# EAGLE design analog_board_fin_proto (EAGLE 9.6.2)
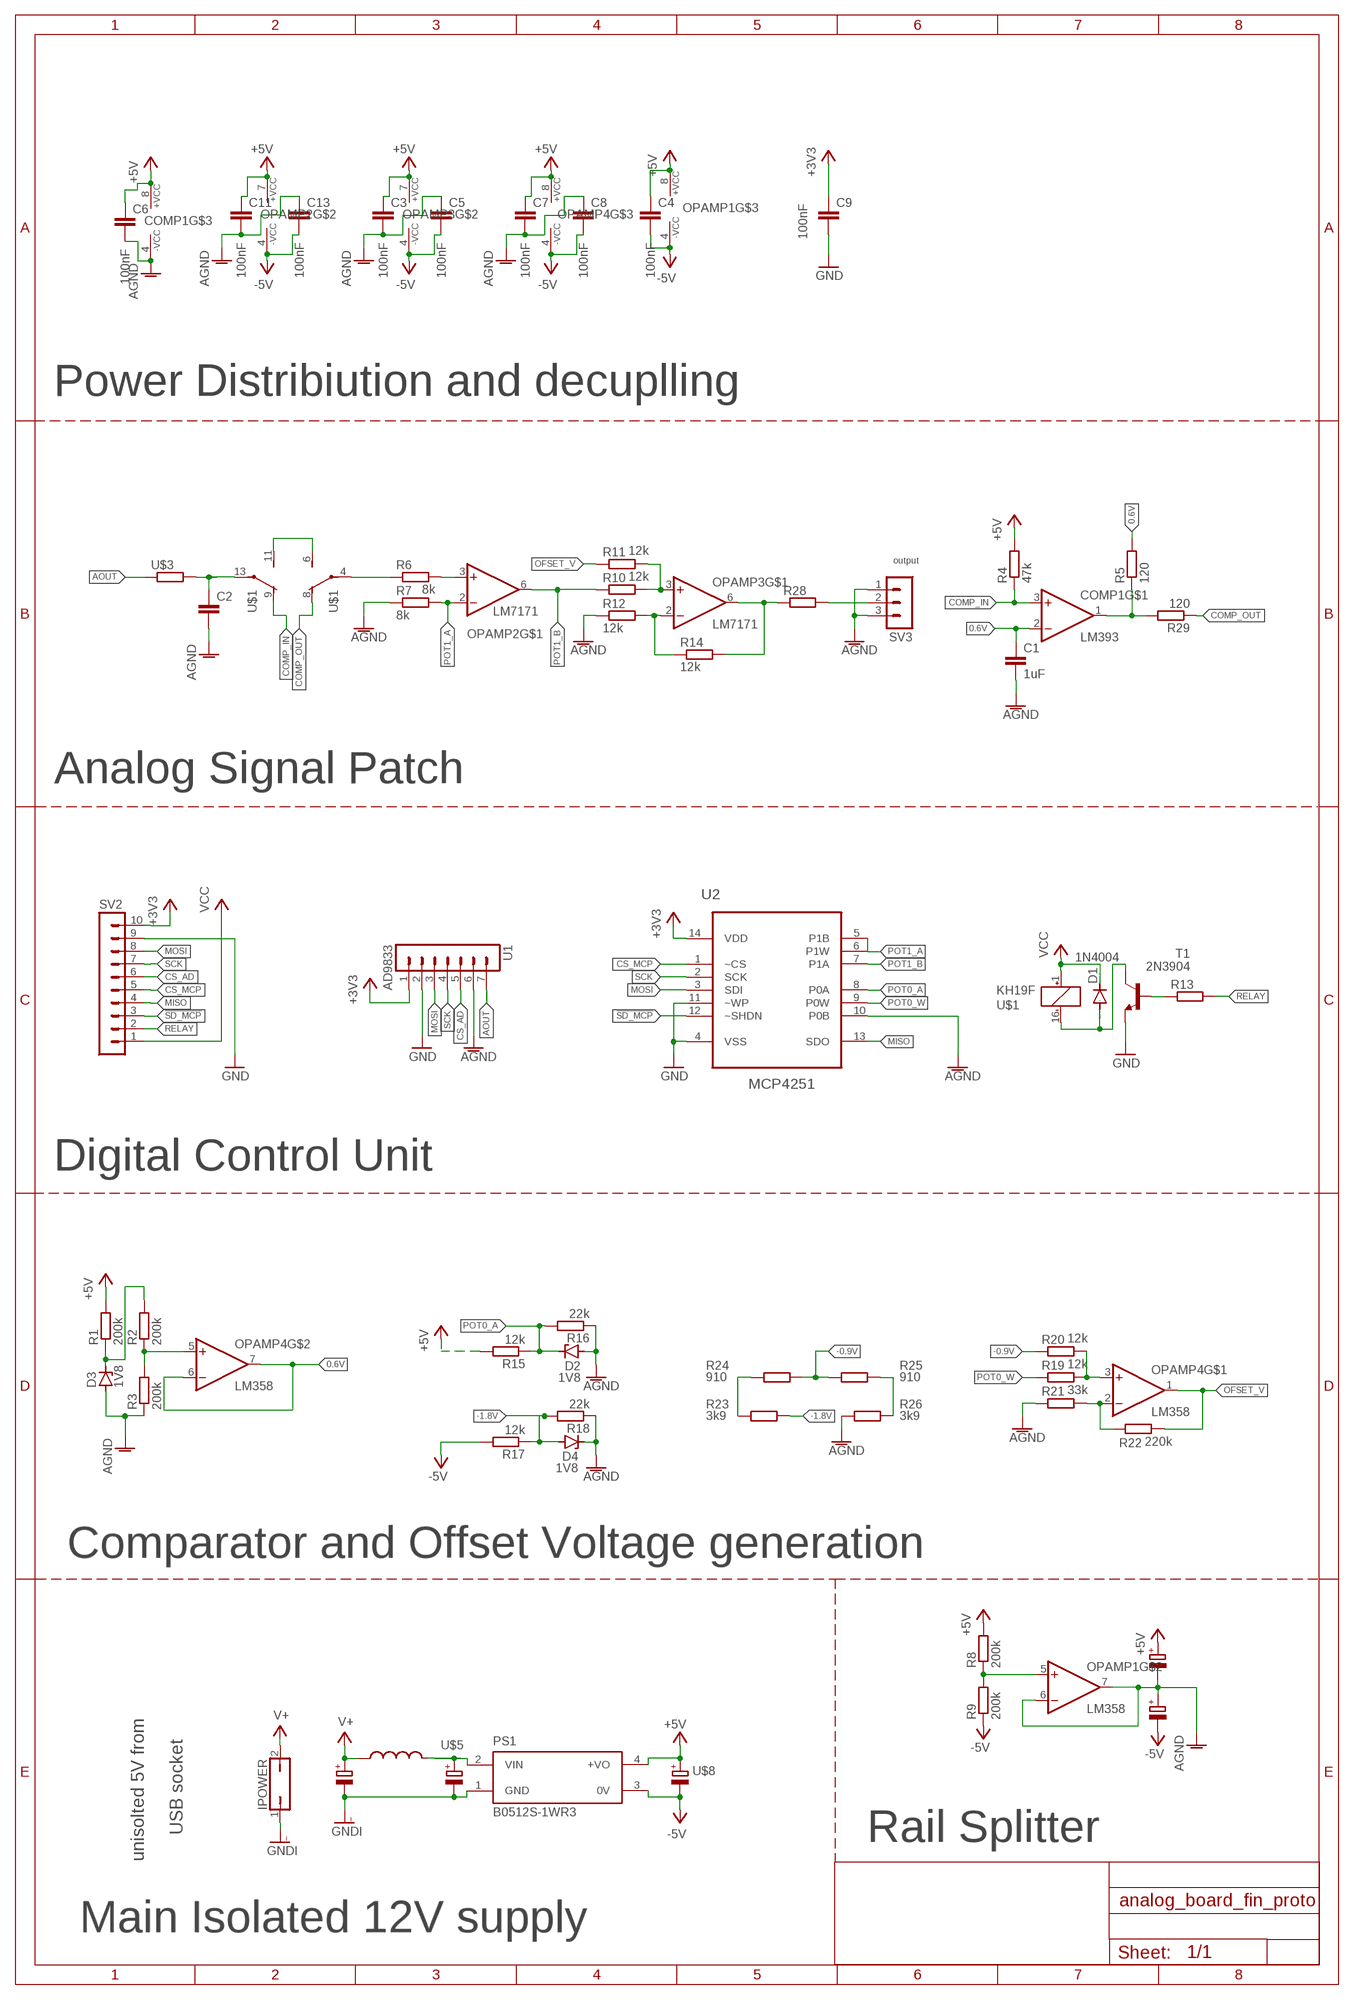
[diagram p0: schematic, sheet 1]

## Parts
C1  1uF  C-EUC0805  [C0805]
C2  C-EU025-025X050  [C025-025X050]
C3  100nF  C-EUC0805  [C0805]
C4  100nF  C-EUC0805  [C0805]
C5  100nF  C-EUC0805  [C0805]
C6  100nF  C-EUC0805  [C0805]
C7  100nF  C-EUC0805  [C0805]
C8  100nF  C-EUC0805  [C0805]
C9  100nF  C-EUC0805  [C0805]
C11  100nF  C-EUC0805  [C0805]
C13  100nF  C-EUC0805  [C0805]
COMP1  LM393  [DIL08]
D1  1N4004  [DO41-10]
D2  1V8  ZENER-DIODESOD80C  [SOD80C]
D3  1V8  ZENER-DIODESOD80C  [SOD80C]
D4  1V8  ZENER-DIODESOD80C  [SOD80C]
IPOWER  POT  JP1Q  [JP1]
OPAMP1  LM358  [DIL08]
OPAMP2  LM7171  [DIL08]
OPAMP3  LM7171  [DIL08]
OPAMP4  LM358  [DIL08]
PS1  B0512S-1WR3  [CONV_B0512S-1WR3]
R1  200k  R-EU_R0805  [R0805]
R2  200k  R-EU_R0805  [R0805]
R3  200k  R-EU_R0805  [R0805]
R4  47k  R-EU_R0805  [R0805]
R5  120  R-EU_R0805  [R0805]
R6  8k  R-EU_R0805  [R0805]
R7  8k  R-EU_R0805  [R0805]
R8  200k  R-EU_R0805  [R0805]
R9  200k  R-EU_R0805  [R0805]
R10  12k  R-EU_R0805  [R0805]
R11  12k  R-EU_R0805  [R0805]
R12  12k  R-EU_R0805  [R0805]
R13  R-EU_R0805  [R0805]
R14  12k  R-EU_R0805  [R0805]
R15  12k  R-EU_R0805  [R0805]
R16  22k  R-EU_R0805  [R0805]
R17  12k  R-EU_R0805  [R0805]
R18  22k  R-EU_R0805  [R0805]
R19  12k  R-EU_R0805  [R0805]
R20  12k  R-EU_R0805  [R0805]
R21  33k  R-EU_R0805  [R0805]
R22  220k  R-EU_R0805  [R0805]
R23  3k9  R-EU_R0805  [R0805]
R24  910  R-EU_R0805  [R0805]
R25  910  R-EU_R0805  [R0805]
R26  3k9  R-EU_R0805  [R0805]
R28  R-EU_R2512  [R2512]
R29  120  R-EU_R0805  [R0805]
SV2  MA10-1  [MA10-1]
SV3  MA03-1  [MA03-1]
T1  2N3904  [TO92]
U1  AD9833  MA07-1  [MA07-1]
U2  MCP4251  [DIL14]
U$1  KH19F  [BT-XX-S]
U$3  RESISTOR  [0207/10]
U$5  CAPACITOR  [E2,5-7]
U$6  100nF  CAPACITOR  [E2,5-7]
U$7  INDUCTOR  [0207/10]
U$8  CAPACITOR  [E2,5-7]
U$9  CAPACITOR  [E2,5-7]
U$10  CAPACITOR  [E2,5-7]

## Nets
0.6V: C1.1 COMP1.2(-IN) OPAMP4.6(-IN) OPAMP4.7(OUT) R5.2
!SD_MCP: SV2.3 U2.12(~SHDN)
+3V3: C9.1 SV2.10 U1.1 U2.14(VDD)
+5V: C3.1 C4.1 C6.1 C7.1 C11.1 COMP1.8(VCC) OPAMP1.8(VCC) OPAMP2.7(VCC) OPAMP3.7(VCC) OPAMP4.8(VCC) PS1.4(+VO) R1.2 R4.2 R8.2 R15.2 U$8.+ U$9.+
-0.9V: R20.1 R24.1 R25.2
-1.8V: D4.A R17.1 R18.2 R23.2
-5V: C4.2 C5.2 C8.2 C13.2 OPAMP1.4(GND) OPAMP2.4(GND) OPAMP3.4(GND) OPAMP4.4(GND) PS1.3(0V) R9.1 R17.2 U$8.- U$10.-
AGND: C1.2 C2.2 C3.2 C5.1 C6.2 C7.2 C8.1 C11.2 C13.1 COMP1.4(GND) D2.A D3.A D4.C OPAMP1.6(-IN) OPAMP1.7(OUT) R3.1 R7.1 R12.1 R16.1 R18.1 R21.1 R26.1 SV3.1 SV3.3 U1.6 U2.10(P0B) U$9.- U$10.+
AOUT: U1.7 U$3.1
COMP_IN: COMP1.3(+IN) R4.1 U$1.9(O)
COMP_OUT: R29.1 U$1.8(O)
CS_AD: SV2.6 U1.5
CS_MCP: SV2.5 U2.1(~CS)
GND: C9.2 SV2.9 T1.3(E) U1.2 U2.4(VSS) U2.11(~WP)
GNDI: IPOWER.1 PS1.1(GND) U$5.- U$6.-
MISO: SV2.4 U2.13(SDO)
MOSI: SV2.8 U1.3 U2.3(SDI)
N$1: OPAMP4.5(+IN) R2.1 R3.2
N$2: U$1.6(S) U$1.11(S)
N$3: C2.1 U$1.13(P) U$3.2
N$4: D3.C R1.1 R2.2
N$5: OPAMP3.3(+IN) R10.2 R11.2
N$6: R6.1 U$1.4(P)
N$7: OPAMP3.6(OUT) R14.2 R28.1
N$8: OPAMP3.2(-IN) R12.2 R14.1
N$9: OPAMP1.5(+IN) R8.1 R9.2
N$10: OPAMP4.3(+IN) R19.2 R20.2
N$11: R28.2 SV3.2
N$12: OPAMP2.3(+IN) R6.2
N$13: R23.1 R24.2
N$14: OPAMP4.2(-IN) R21.2 R22.1
N$15: R25.1 R26.2
N$17: PS1.2(VIN) U$5.+ U$7.2
N$18: D1.A T1.1(C) U$1.16(-)
N$19: COMP1.1(OUT) R5.1 R29.2
N$21: R13.1 T1.2(B)
OFSET_V: OPAMP4.1(OUT) R11.1 R22.2
POT0_A: D2.C R15.1 R16.2 U2.8(P0A)
POT0_W: R19.1 U2.9(P0W)
POT1_A: OPAMP2.2(-IN) R7.2 U2.5(P1B) U2.6(P1W)
POT1_B: OPAMP2.6(OUT) R10.1 U2.7(P1A)
RELAY: R13.2 SV2.2
SCK: SV2.7 U1.4 U2.2(SCK)
V+: IPOWER.2 U$6.+ U$7.1
VCC: D1.C SV2.1 U$1.1(+)
Unconnected: COMP1.5(+IN) COMP1.6(-IN) COMP1.7(OUT) OPAMP1.1(OUT) OPAMP1.2(-IN) OPAMP1.3(+IN)

## Notes on the sheet
- Power Distribiution and decuplling
- output
- Analog Signal Patch
- Digital Control Unit
- Comparator and Offset Voltage generation
- unisolted 5V from
- USB socket
- Rail Splitter
- Main Isolated 12V supply

## Library data of the parts
C1-C9 C11 C13 = rcl:C-EU: CAPACITOR, European symbol; SPICEPREFIX: C
COMP1 = for_hommade_printing:LM393
D1 = diode:1N4004: DIODE general purpose rectifier, 1 A
D2-D4 = diode:ZENER-DIODE: Z-Diode
IPOWER = jumper:JP1Q: JUMPER
OPAMP1 OPAMP4 = for_hommade_printing:LM358
OPAMP2 OPAMP3 = for_hommade_printing:LM7171
PS1 = for_hommade_printing:B0512S-1WR3: DC/DC Converter Check availability <https://pricing.snapeda.com/parts/B0512S-1WR3/Mornsun%20America%2C%20LLC/view-part?ref=eda>; AVAILABILITY: In Stock; DESCRIPTION: Isolated Module DC DC Converter 1 Output 12V - - - 84mA 4.5V - 5.5V Input; MF: Mornsun America, LLC; MP: B0512S-1WR3; PACKAGE: SIP-4-4 MORNSUN; PRICE: None; PURCHASE-URL: https://pricing.snapeda.com/search/part/B0512S-1WR3/?ref=eda
R1-R26 R28 R29 = rcl:R-EU_: RESISTOR, European symbol; SPICEPREFIX: R
SV2 = con-lstb:MA10-1: PIN HEADER; OC_FARNELL: unknown; OC_NEWARK: unknown
SV3 = con-lstb:MA03-1: PIN HEADER; OC_FARNELL: unknown; OC_NEWARK: unknown
T1 = transistor:2N3904: NPN TRANSISTOR
U1 = con-lstb:MA07-1: PIN HEADER; OC_FARNELL: unknown; OC_NEWARK: unknown
U2 = for_hommade_printing:MCP4251
U$1 = for_hommade_printing:KH19F
U$3 = for_hommade_printing:RESISTOR
U$5 U$6 U$8-U$10 = for_hommade_printing:CAPACITOR
U$7 = for_hommade_printing:INDUCTOR

## Board
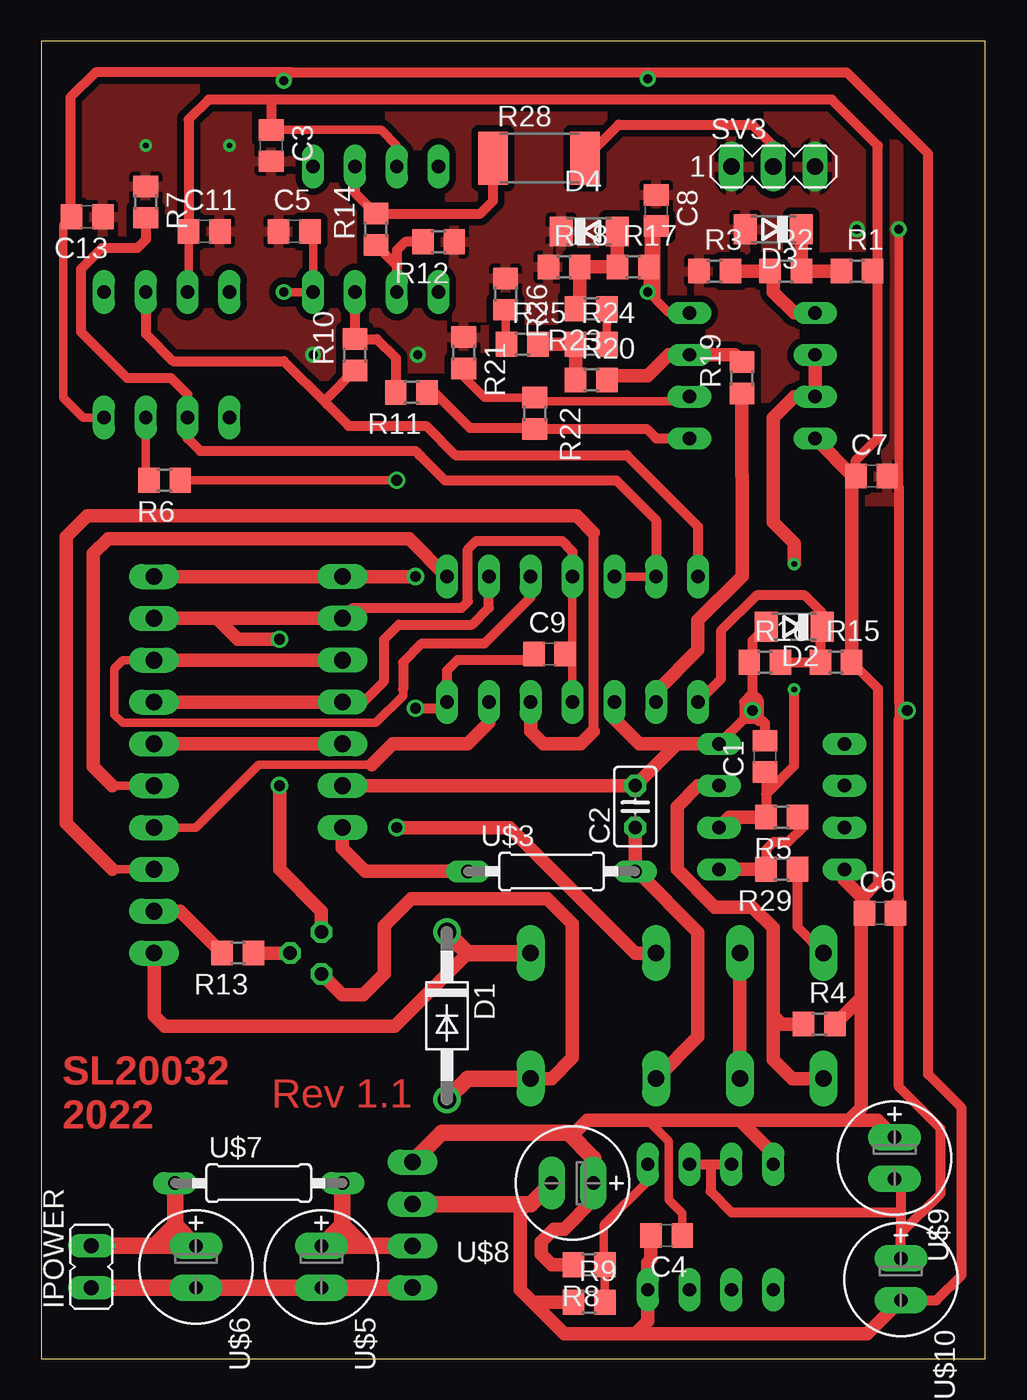
[diagram p1: board, top side]
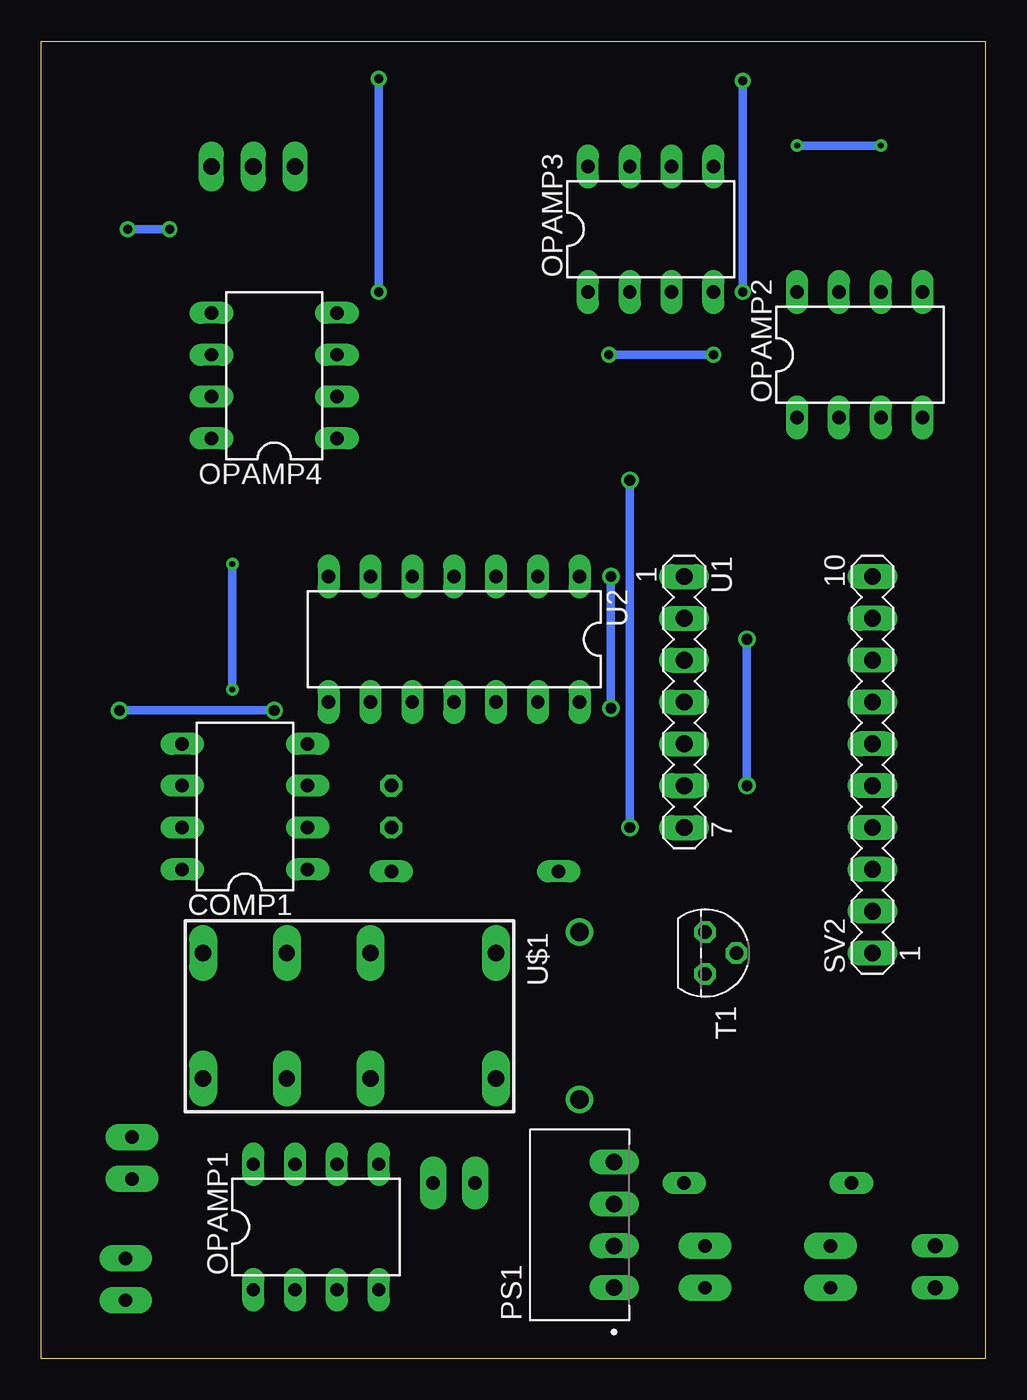
[diagram p2: board, bottom side, seen from below]

Size 57.33 x 80 mm. Coordinates in mm from the lower left corner, seen from the top.
Outline: 0,0 57.33,0 57.33,80 0,80 0,0
Copper layers (1*16): Top 0.035mm / dielectric 1.5mm / Bottom 0.035mm
Design rules "default *": minimum track width 6mil, minimum drill 0.35mm, track to track 10mil, track to pad 10mil, pad to pad 10mil, via to via 10mil, smd to smd 10mil, copper to edge 40mil, drill to drill 6mil, minimum pad ring 10mil, minimum via ring 8mil, stop-mask expansion 4mil, vias tented up to drill 0mil, thermal gap 10mil

### Footprints (pad centres in the part's own frame; a part is rotated, then mirrored left to right if it is on the bottom)
C0805 = smd 1.3 x 1.5: 1 -0.95,0; 2 0.95,0
C025-025X050 = drill 0.813 octagon: 1 -1.27,0; 2 1.27,0
DIL08 = drill 0.813 long: 1 -3.81,-3.81; 2 -1.27,-3.81; 3 1.27,-3.81; 4 3.81,-3.81; 5 3.81,3.81; 6 1.27,3.81; 7 -1.27,3.81; 8 -3.81,3.81
DO41-10 = drill 1.118: A 5.08,0; C -5.08,0
SOD80C = smd 1.4 x 1.8: A 1.7,0; C -1.7,0
JP1 = drill 0.914 long: 1 0,-1.27; 2 0,1.27
CONV_B0512S-1WR3 = drill 1 long: 1 -3.81,-2.1; 2 -1.27,-2.1; 3 1.27,-2.1; 4 3.81,-2.1
R0805 = smd 1.3 x 1.5: 1 -0.95,0; 2 0.95,0
R2512 = smd 1.8 x 3.2: 1 -2.8,0; 2 2.8,0
MA10-1 = drill 1.016 long: 1 -11.43,0; 2 -8.89,0; 3 -6.35,0; 4 -3.81,0; 5 -1.27,0; 6 1.27,0; 7 3.81,0; 8 6.35,0; 9 8.89,0; 10 11.43,0
MA03-1 = drill 1.016 long: 1 -2.54,0; 2 0,0; 3 2.54,0
TO92 = drill 0.813 octagon: 1 1.27,0; 2 0,1.905; 3 -1.27,0
MA07-1 = drill 1.016 long: 1 -7.62,0; 2 -5.08,0; 3 -2.54,0; 4 0,0; 5 2.54,0; 6 5.08,0; 7 7.62,0
DIL14 = drill 0.813 long: 1 -7.62,-3.81; 2 -5.08,-3.81; 3 -2.54,-3.81; 4 0,-3.81; 5 2.54,-3.81; 6 5.08,-3.81; 7 7.62,-3.81; 8 7.62,3.81; 9 5.08,3.81; 10 2.54,3.81; 11 0,3.81; 12 -2.54,3.81; 13 -5.08,3.81; 14 -7.62,3.81
BT-XX-S = drill 1 pad 1.7 long: 1 -8.89,-3.81; 4 -1.27,-3.81; 6 3.81,-3.81; 8 8.89,-3.81; 9 8.89,3.81; 11 3.81,3.81; 13 -1.27,3.81; 16 -8.89,3.81
0207/10 = drill 0.813 long: 1 -5.08,0; 2 5.08,0
E2,5-7 = drill 0.813 pad 1.6 long: + -1.27,0; - 1.27,0

### Placement (x,y rotation side)
C1  43.94,36.58 90 top
C2  36.07,33.53 90 top
C3  13.97,73.66 270 top
C4  37.97,7.49 180 top
C5  15.37,68.45 0 top
C6  50.93,27.05 0 top
C7  50.42,53.59 0 top
C8  37.34,69.72 270 top
C9  30.86,42.8 0 top
C11  9.91,68.45 0 top
C13  2.79,69.34 180 top
COMP1  44.96,33.53 90 bottom
D1  24.64,20.83 270 top
D2  45.72,44.45 180 top
D3  44.45,68.58 180 top
D4  33.27,68.45 0 top
IPOWER  3.05,5.59 0 top
OPAMP1  40.64,8 0 bottom
OPAMP2  7.62,60.96 0 bottom
OPAMP3  20.32,68.58 0 bottom
OPAMP4  43.18,59.69 90 bottom
PS1  24.64,8.13 90 bottom
R1  49.53,66.04 0 top
R2  45.21,66.04 0 top
R3  40.89,66.04 0 top
R4  47.24,20.32 0 top
R5  44.96,32.89 180 top
R6  7.49,53.34 180 top
R7  6.35,70.23 270 top
R8  33.27,5.71 180 top
R9  33.27,3.43 0 top
R10  19.05,60.96 90 top
R11  22.48,58.67 180 top
R12  24.13,67.82 180 top
R13  11.94,24.64 180 top
R14  20.32,68.58 90 top
R15  48.26,42.29 0 top
R16  43.94,42.29 0 top
R17  35.94,66.29 0 top
R18  31.75,66.29 0 top
R19  42.55,59.56 90 top
R20  33.4,59.44 0 top
R21  25.65,61.09 270 top
R22  29.97,57.4 270 top
R23  33.4,63.75 180 top
R24  33.4,61.59 0 top
R25  29.21,61.59 0 top
R26  28.19,64.64 270 top
R28  30.23,72.9 0 top
R29  44.96,29.72 180 top
SV2  6.86,36.07 90 bottom
SV3  44.45,72.39 0 top
T1  17.02,24.64 270 bottom
U1  18.29,39.88 270 bottom
U2  32.26,43.69 180 bottom
U$1  38.61,20.83 180 bottom
U$3  30.99,29.59 0 top
U$5  17.02,5.59 270 top
U$6  9.4,5.59 270 top
U$7  13.21,10.67 0 top
U$8  32.26,10.67 180 top
U$9  51.82,12.19 270 top
U$10  52.2,4.83 270 top

### Tracks (layer width: path | path; a pad name or v marks a point on that pad's centre or on a via)
0.6V  (via drill 0.35)
  Top 0.508: OPAMP4.7 45.72,58.42 | C1.1 44.01,35.56
  Top 0.61: 44.01,35.56 44.01,34.29 | 44.01,34.29 R5.2 | 44.01,34.29 45.72,36 v45.72,40.64
  Top 0.813: R5.2 41.78,32.89 COMP1.2 | OPAMP4.6 OPAMP4.7 | 45.72,58.42 44.45,57.15 44.45,50.8 45.72,49.53 v45.72,48.26
  Bottom 0.508: v45.72,40.64 v45.72,48.26
!SD_MCP
  Top 0.508: SV2.3 4.32,29.72
  Top 0.61: 33.53,50.16 33.53,38.1
  Top 0.813: 4.32,29.72 1.52,32.51 1.52,49.91 2.79,51.18 32.51,51.18 33.53,50.16 | 33.53,38.1 32.77,37.34 30.48,37.34 29.72,38.1 U2.12
+3V3  (via drill 0.65)
  Top 0.508: C9.1 29.53,42.42
  Top 0.61: v22.73,39.5 24.26,39.5 U2.14 24.64,41.78 25.27,42.42 29.53,42.42
  Top 0.813: SV2.10 U1.1 v22.73,47.5
  Bottom 0.508: v22.73,47.5 v22.73,39.5
+5V
  Top 0.508: U$8.+ 33.53,9.65 | 32,13.72 32.38,13.72 | 44.45,12.45 OPAMP1.8 | 49.78,26.67 49.98,26.86 C6.1 49.91,27.12 49.91,27.94 | C11.1 8.96,64.84 OPAMP2.7 | OPAMP3.7 21.59,73.66 20.64,74.61 C3.1 | 50.8,66.36 R1.2 50.8,65.72 | 36.83,14.48 38.1,13.21 38.1,9.65 38.92,8.83 C4.1 | 49.21,53.34 C7.1 49.28,53.59 | 48.77,29.08 COMP1.8
  Top 0.61: R15.2 50.8,40.7 50.8,28.83 49.91,27.94 | 50.8,66.36 50.8,73.66 48.01,76.45 13.97,76.45 | 13.97,76.45 10.16,76.45 8.96,75.25 C11.1 | 13.97,76.45 C3.1 | C7.1 49.47,54.55 50.8,55.88 50.8,65.72
  Top 0.813: R8.2 30.99,5.71 30.35,6.35 30.35,7.11 31.11,7.87 31.75,7.87 33.53,9.65 | 42.42,14.48 36.83,14.48 33.15,14.48 32.38,13.72 | 42.42,14.48 49.02,14.48 | 49.02,14.48 49.78,15.24 49.78,21.91 | 42.42,14.48 44.45,12.45 | 49.78,26.67 49.78,21.91 | R4.2 49.78,21.91 | 49.02,14.48 50.8,14.48 U$9.+ | R15.2 49.21,53.34 | OPAMP4.8 49.28,53.59 | 49.91,27.94 48.77,29.08
  Top 1.016: U$8.+ 33.53,12.19 32,13.72 24.32,13.72 PS1.4
-0.9V
  Top 0.813: R25.2 R24.1 R20.1
-1.8V
  Top 0.508: D4.A 34.99,68.44 | 32.7,64 R23.2
  Top 0.813: 34.99,68.44 R17.1 R18.2 32.7,64
-5V  (via drill 0.55)
  Top 0.508: 29.72,9.4 29.08,8.76 | C5.2 16.51,68.26 OPAMP3.4 v14.73,64.77 | OPAMP2.4 2.54,57.15 1.34,58.35 1.34,68.83 C13.2 1.78,69.41 | 15.24,78.11 v14.73,77.6 | 36.83,78.11 v36.83,77.72 | OPAMP4.4 38.1,63.5 37.34,64.26 | 37.34,64.26 v36.83,64.77 36.83,66.23 R17.2 36.89,68.33 C8.2 37.34,64.26
  Top 0.61: U$10.- 54.36,3.56 55.88,5.08 55.88,15.24 53.85,17.27 53.85,73.15 48.9,78.11 36.83,78.11 15.24,78.11 3.3,78.11 1.78,76.58 1.78,69.41
  Top 0.813: 29.84,3.43 29.08,4.19 29.08,8.76 | 29.84,3.43 R9.1 | 29.84,3.43 31.75,1.52 36.07,1.52 | 36.07,1.52 36.83,2.29 OPAMP1.4 36.83,5.84 37.02,6.04 C4.2 | U$10.- 50.16,1.52 36.07,1.52
  Top 1.016: U$8.- 29.72,9.4 PS1.3
  Bottom 0.508: v14.73,77.6 v14.73,64.77 | v36.83,77.72 v36.83,64.77
AGND  (via drill 0.35, 0.55, 0.65)
  Top 0.508: U$9.- 52.2,10.54 | 42.67,38.86 v43.18,39.37 43.81,38.73 43.56,38.73 | C6.2 51.88,27.75 | U2.10 34.8,38.86 | 43.18,41.66 42.99,41.84 R16.1 43.18,42.48 | C7.2 52.07,52.89 v52.07,68.58 | 52.07,38.86 52.07,39.88 v52.58,39.37 52.07,38.86
  Top 0.61: OPAMP1.6 40.64,11.81 | 40.64,11.81 OPAMP1.7 | 52.2,10.54 52.2,8.89 | U$10.+ 52.2,7.62 | 52.2,8.89 52.2,7.62 | 40.64,11.81 40.64,10.16 41.91,8.89 52.2,8.89 | 52.2,7.62 54.61,10.03 54.61,13.97 52.07,16.51 52.07,27.94 | 52.07,27.94 52.07,38.86 | COMP1.4 42.67,38.86 | 51.88,27.75 52.07,27.94 | 43.18,41.66 43.18,40.39 | 43.18,40.39 v43.18,39.37 | D2.A 43.18,43.61 43.18,42.48 | C1.2 43.94,38.61 43.81,38.73 | 52.07,52.89 52.07,39.88 | 42.67,38.86 43.56,38.86 | 43.18,40.39 43.56,40.01 43.56,38.86 | 43.56,38.86 43.56,38.73 | 43.18,40.39 42.67,39.88 42.67,38.86
  Top 0.813: U1.6 C2.2 38.61,37.34 | 38.61,37.34 COMP1.4 | 38.61,37.34 36.32,37.34 34.8,38.86
  Bottom 0.508: v43.18,39.37 v52.58,39.37 | v52.07,68.58 v49.53,68.58 | v16.51,60.96 v22.86,60.96 | v6.35,73.66 v11.43,73.66
  pour Top (isolate 0.406): 0,80.01 0,52.07 52.07,52.07 52.07,80.01
AOUT
  Top 0.813: U1.7 18.29,30.99 19.68,29.59 U$3.1
COMP_IN
  Top 0.508: COMP1.3 39.88,34.8
  Top 0.813: 39.88,34.8 38.61,33.53 38.61,29.72 40.89,27.43 43.18,27.43 44.45,26.16 44.45,20.83 | U$1.9 45.59,17.02 44.45,18.16 44.45,20.83 | 44.45,20.83 44.96,20.32 R4.1
COMP_OUT
  Top 0.61: R29.1 45.91,26.23 U$1.8
CS_AD
  Top 0.813: SV2.6 U1.5
CS_MCP
  Top 0.508: SV2.5 4.32,34.8
  Top 0.813: 4.32,34.8 3.17,35.94 3.17,48.9 4.06,49.78 22.35,49.78 U2.1
GND  (via drill 0.65)
  Top 0.508: U2.4 32.26,43.18 | 32.26,43.18 U2.11 | C9.2 32.19,43.18 32.26,43.18
  Top 0.61: U1.2 18.92,45.59 25.53,45.59 25.91,45.97 25.91,49.15 26.42,49.66 31.62,49.66 32.26,49.02 U2.4
  Top 0.813: U1.2 10.67,44.96 | 10.67,44.96 SV2.9 | 10.67,44.96 11.94,43.69 v14.48,43.69 | v14.48,34.8 14.48,29.72 17.02,27.18 T1.3
  Bottom 0.508: v14.48,43.69 v14.48,34.8
GNDI
  Top 1.016: IPOWER.1 U$6.- U$5.- PS1.1
MISO
  Top 0.508: SV2.4 9.4,32.26 13.21,36.07 20.07,36.07
  Top 0.813: 20.07,36.07 21.34,37.34 25.91,37.34 27.18,38.61 U2.13
MOSI
  Top 0.508: 29.72,46.23 U2.3 | 5.71,42.42 SV2.8 4.95,42.42 4.45,41.91 4.45,39.12 4.95,38.61 20.32,38.61 21.97,40.26 21.97,40.64
  Top 0.61: 29.72,46.23 26.92,43.43 23.11,43.43 21.97,42.29 21.97,40.64
  Top 0.813: U1.3 SV2.8
N$1
  Top 0.508: R2.1 44.45,65.85
  Top 0.813: R3.2 R2.1 | 44.45,65.85 44.45,64.77 45.72,63.5 OPAMP4.5
N$2
  Top 0.813: U$1.6 U$1.11
N$3
  Top 0.508: U$3.2 36.2,29.59
  Top 0.813: U$1.13 39.88,19.56 39.88,25.91 36.2,29.59 | C2.1 U$3.2
N$4
  Top 0.508: D3.C 46.16,68.57
  Top 0.813: R1.1 R2.2 46.16,68.57
N$5
  Top 0.61: OPAMP3.3 R10.2 20.39,61.91 21.53,60.77 R11.2
N$6  (via drill 0.65)
  Top 0.508: R6.1 v21.59,53.34
  Top 0.813: U$1.4 36.07,24.64 28.45,32.26 v21.59,32.26
  Bottom 0.508: v21.59,32.26 v21.59,53.34
N$7
  Top 0.61: OPAMP3.6 19.05,70.8 R14.2 26.67,69.53 27.43,70.29 R28.1
N$8
  Top 0.61: R14.1 21.59,66.36 | 21.59,66.36 OPAMP3.2 | R12.2 22.1,67.82 21.59,67.31 21.59,66.36
N$9
  Top 0.508: R9.2 R8.1 34.16,5.78 34.16,8.13 36.83,10.79 OPAMP1.5
N$10
  Top 0.508: R20.2 34.6,59.69 | 38.1,60.96 OPAMP4.3
  Top 0.813: 34.6,59.69 36.83,59.69 38.1,60.96 | OPAMP4.3 42.1,60.96 R19.2
N$11
  Top 0.508: 44.45,73.66 SV3.2
  Top 0.61: R28.2 35.06,74.93 43.18,74.93 44.45,73.66
N$12
  Top 0.508: R6.2 6.35,53.53 OPAMP2.3
N$13
  Top 0.508: R23.1 R24.2
N$14
  Top 0.508: R21.2 25.65,59.62 26.92,58.35 R22.1 29.97,58.17 30.01,58.13 39.08,58.13 OPAMP4.2
N$15
  Top 0.508: R26.2 28.19,61.66 R25.1
N$17
  Top 1.016: U$7.2 18.29,8.13 | 18.29,8.13 U$5.+ 19.56,6.86 | 18.29,8.13 19.56,6.86 | PS1.2 19.56,6.86
N$18
  Top 0.813: U$1.16 30.99,17.02 32.26,18.29 32.26,26.42 30.73,27.94 22.48,27.94 20.83,26.29 20.83,23.37 19.56,22.1 18.29,22.1 T1.1
  Top 1.016: D1.A 25.91,17.02 U$1.16
N$19
  Top 0.508: R5.1 46.23,32.57 46.23,32.26
  Top 0.61: 46.23,32.26 45.34,31.37 44.45,31.37 44.01,30.93 R29.2
  Top 0.813: COMP1.1 R29.2
N$21
  Top 0.813: R13.1 T1.2
OFSET_V
  Top 0.508: R11.1 23.88,58.67 | 29.91,56.52 R22.2
  Top 0.61: 23.88,58.67 26.04,56.52 29.91,56.52 | R22.2 36.76,56.45 37.34,55.88 OPAMP4.1
POT0_A
  Top 0.508: 47.31,44.34 D2.C 47.42,45.29
  Top 0.61: R16.2 R15.1 47.31,44.34 | U2.8 41.27,41.27 41.27,44.2 43.43,46.35 46.35,46.35 47.42,45.29
POT0_W
  Top 0.508: U2.9 37.34,40.51 | 42.55,53.64 42.57,53.61
  Top 0.813: 37.34,40.51 39.88,43.05 39.88,44.83 42.57,47.52 42.57,53.61 | R19.1 42.55,53.64
POT1_A
  Top 0.508: U2.5 U2.6 | 8.89,55.88 OPAMP2.2 8.89,58.55
  Top 0.61: 8.89,55.88 9.65,55.12 12.7,55.12 13.27,55.12 22.73,55.12 23.05,54.8 24.51,53.34 34.92,53.34 37.34,50.93 U2.6 | R7.2 6.35,67.94 5.84,67.44 3.68,67.44 2.41,66.17 2.41,62.36 5.21,59.56 7.87,59.56 8.89,58.55
POT1_B
  Top 0.508: 17.34,58.3 17.34,57.98
  Top 0.61: OPAMP2.6 6.35,62.23 8,60.58 14.73,60.58 17.34,57.98 18.67,56.64 23.37,56.64 25.15,54.86 35.56,54.86 39.88,50.55 U2.7 | R10.1 17.34,58.3
RELAY
  Top 0.813: R13.2 8.45,27.18 SV2.2
SCK
  Top 0.508: U1.4 19.56,39.88
  Top 0.61: 19.56,39.88 20.83,41.15 20.83,43.69 21.72,44.58 26.16,44.58 27.18,45.59 U2.2
  Top 0.813: U1.4 SV2.7
V+
  Top 1.016: IPOWER.2 6.86,6.86 | 6.86,6.86 U$6.+ 8.13,8.13 | U$7.1 8.13,8.13 | 8.13,8.13 6.86,6.86
VCC
  Top 0.813: 25.91,24.64 21.46,20.19 7.49,20.19 6.86,20.83 SV2.1
  Top 1.016: D1.C 25.91,24.64 U$1.1

### Text on the board
Top: Rev 1.1 | SL20032 / 2022